# Altium project edirnekapi.PrjPcb (part 1 of 2)
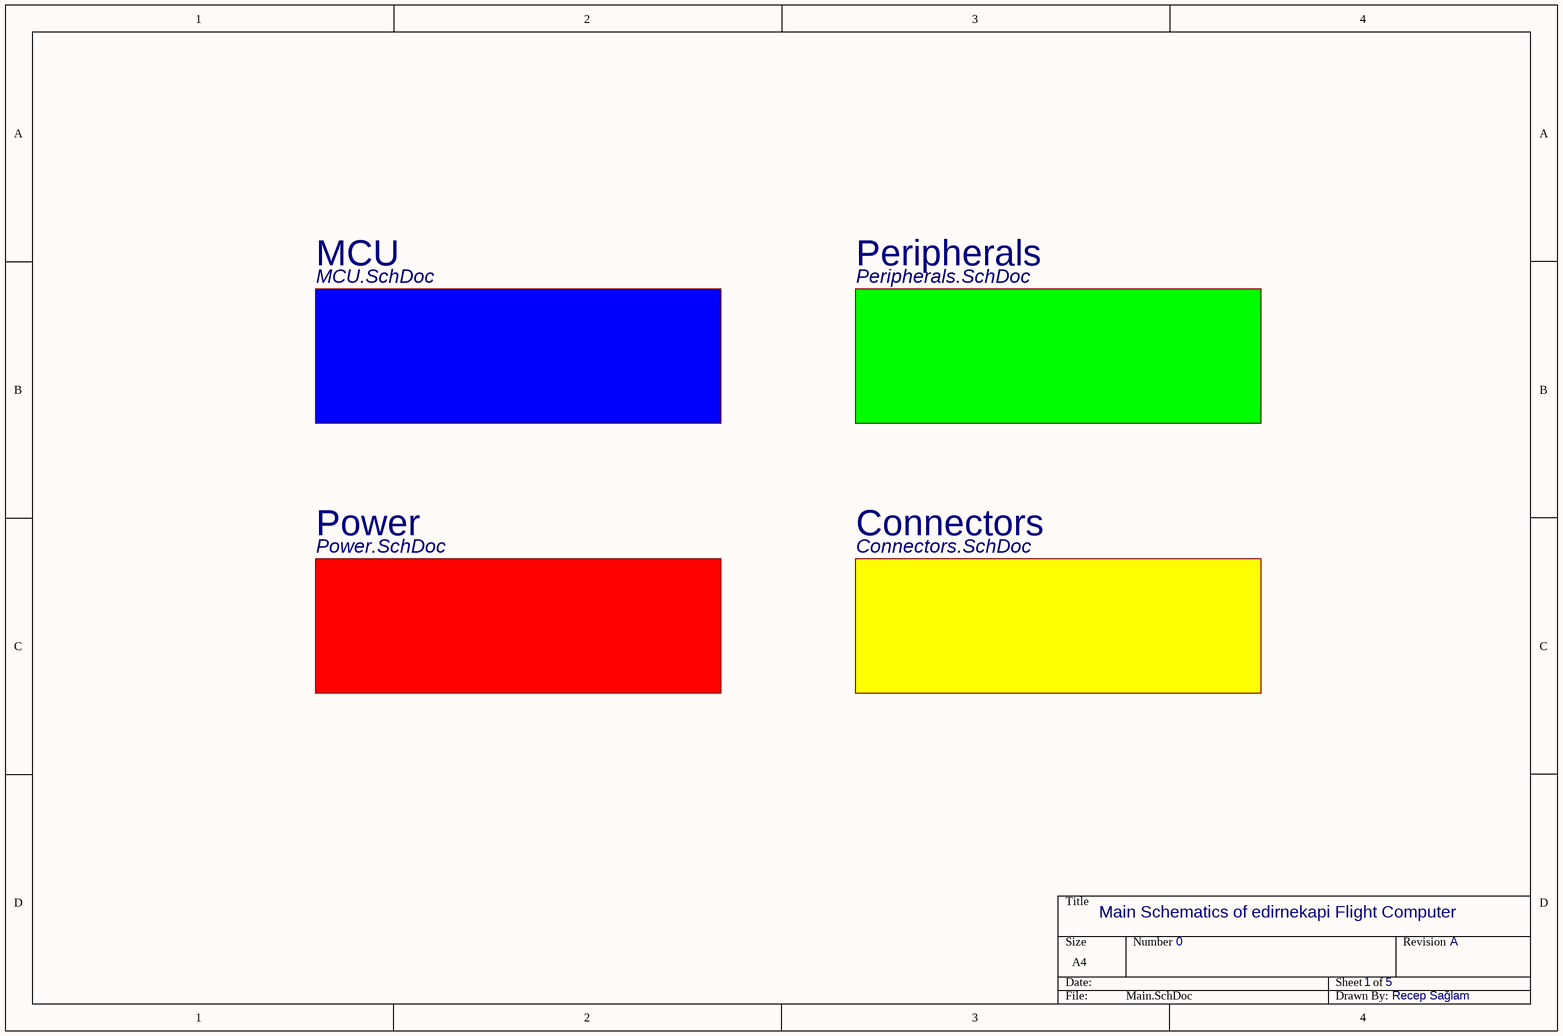
[diagram p0: Main.SchDoc]
5 sheets, 104 parts. Net scope: flat (ports and power ports of the same name join across sheets).
Board file: X3.PcbDoc
Sheets:
  Main.SchDoc
    MCU = MCU.SchDoc
    Peripherals = Peripherals.SchDoc
    Power = Power.SchDoc
    Connectors = Connectors.SchDoc

## Sheet Main.SchDoc
size A4; SheetNumber: 1; SheetTotal: 5

### Sub-sheets
Connectors = Connectors.SchDoc: no entries
MCU = MCU.SchDoc: no entries
Peripherals = Peripherals.SchDoc: no entries
Power = Power.SchDoc: no entries

### Notes on the sheet
- Main Schematics of edirnekapi Flight Computer
- 0
- 1
- 5
- A
- Recep Sağlam

## Sheet MCU.SchDoc
size Letter; SheetNumber: 2; SheetTotal: 5
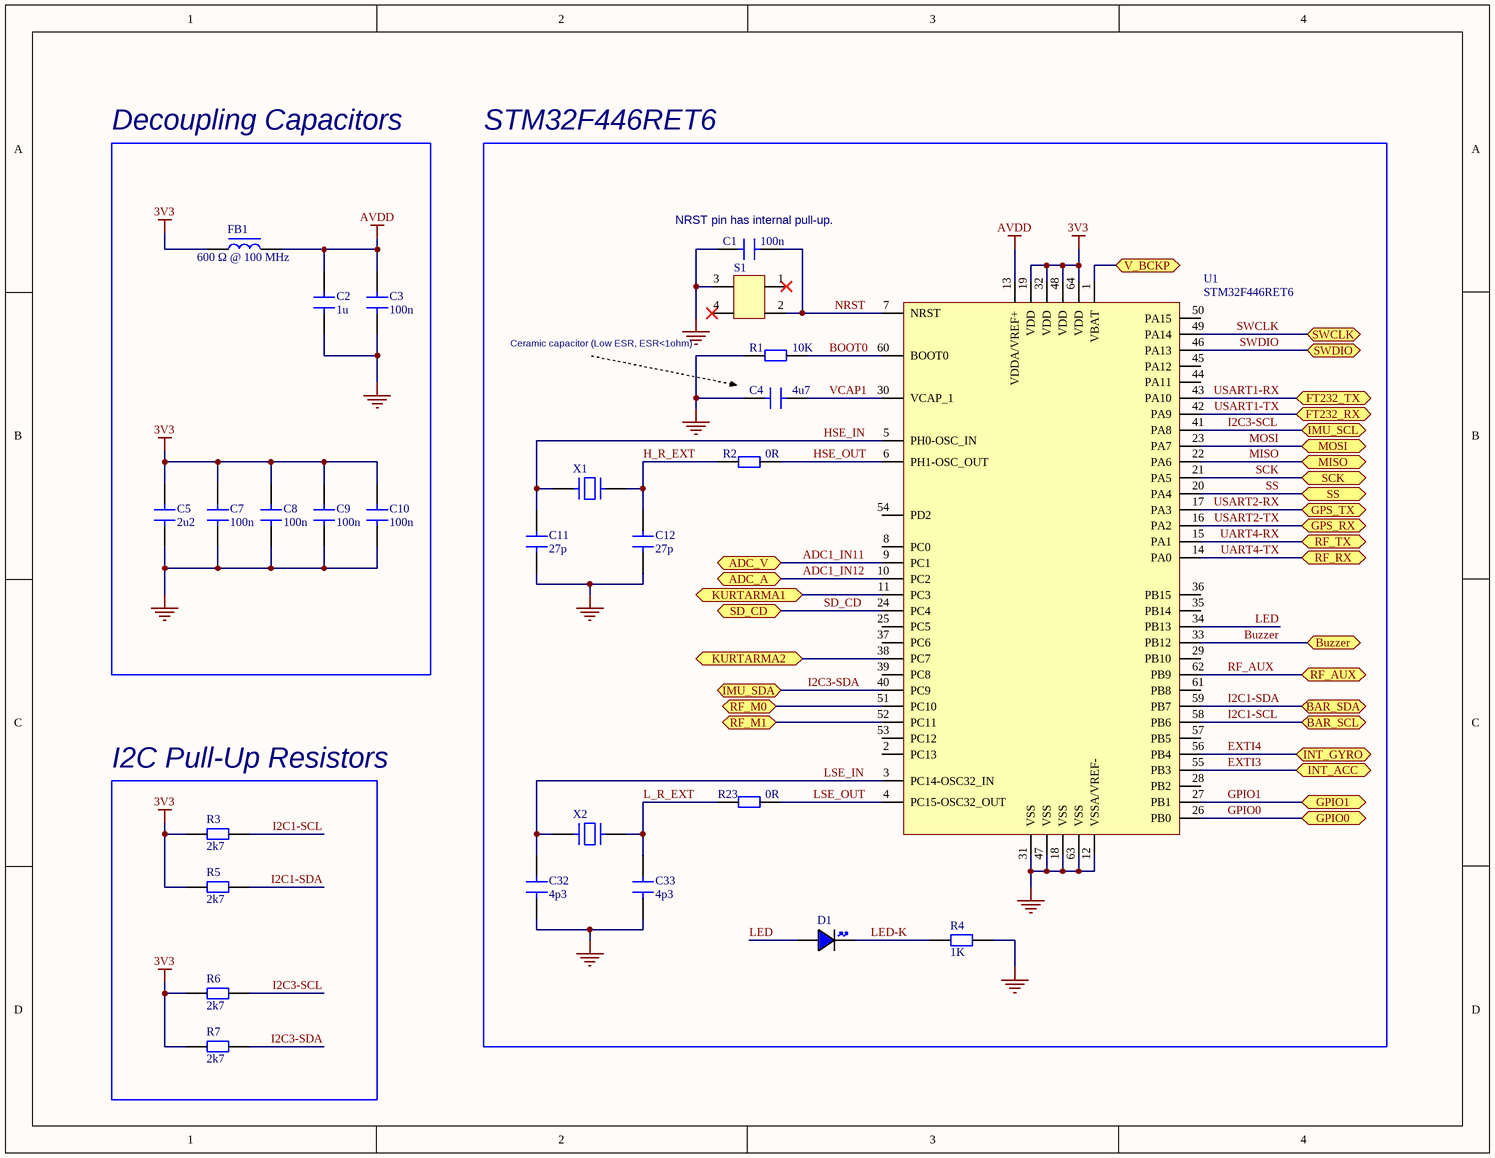
[diagram p1: MCU.SchDoc]

### Parts
C1  100n  [CAP 0603]
C2  1u  [CAP 0805]
C3  100n  [CAP 0603]
C4  4u7  [CAP 0805]
C5  2u2  [CAP 0805]
C7  100n  [CAP 0603]
C8  100n  [CAP 0603]
C9  100n  [CAP 0603]
C10  100n  [CAP 0603]
C11  27p  [CAP 0603]
C12  27p  [CAP 0603]
C32  4p3  [CAP 0603]
C33  4p3  [CAP 0603]
D1  LED 0805 BLUE  [LED 0805 BLUE]  (value not drawn)
FB1  600 Ω @ 100 MHz  [FB 0805]
R1  10K  [RES 0603]
R2  0R  [RES 0603]
R3  2k7  [RES 0603]
R4  1K  [RES 0603]
R5  2k7  [RES 0603]
R6  2k7  [RES 0603]
R7  2k7  [RES 0603]
R23  0R  [RES 0603]
S1  FSM4JSMATR  [FSM4JSMATR]  (value not drawn)
U1  STM32F446RET6  [STM32F446RET6]
X1  ABM3-8.000MHZ-D2Y-T  [ABM3-8.000MHZ-D2Y-T]  (value not drawn)
X2  ABS25-32.768KHZ-6-T  [ABS25-32.768KHZ-6-T]  (value not drawn)

### Blocks framed on the sheet
Decoupling Capacitors: C2 C3 C5 C7-C10 FB1
STM32F446RET6: C1 C4 C11 C12 C32 C33 D1 R1 R2 R4 R23 S1 U1 X1 X2
I2C Pull-Up Resistors: R3 R5-R7

### Ports
ADC_A (bidir, see Power[2D]), ADC_V (bidir, see Power[1C]), BAR_SCL (bidir, see Connectors[3C], Peripherals[3A]), BAR_SDA (bidir, see Connectors[3C], Peripherals[3A]), Buzzer (bidir, see Peripherals[6C]), FT232_RX (bidir, see Connectors[2A]), FT232_TX (bidir, see Connectors[2A]), GPIO0 (bidir, see Connectors[4A]), GPIO1 (bidir, see Connectors[4B]), GPS_RX (bidir, see Peripherals[5C]), GPS_TX (bidir, see Peripherals[5C]), IMU_SCL (bidir, see Connectors[4C], Peripherals[5A]), IMU_SDA (bidir, see Connectors[4C], Peripherals[5A]), INT_ACC (bidir, see Peripherals[6A]), INT_GYRO (bidir, see Peripherals[6A]), KURTARMA1 (bidir, see Peripherals[3D]), KURTARMA2 (bidir, see Peripherals[5D]), MISO (bidir, see Connectors[3A]), MOSI (bidir, see Connectors[3A]), RF_AUX (bidir, see Peripherals[2B], Peripherals[3C]), RF_M0 (bidir, see Peripherals[2C], Peripherals[3B]), RF_M1 (bidir, see Peripherals[2C], Peripherals[3B]), RF_RX (bidir, see Peripherals[2B], Peripherals[3B]), RF_TX (bidir, see Peripherals[2B], Peripherals[3B]), SCK (bidir, see Connectors[3A]), SD_CD (bidir, see Connectors[3B]), SS (bidir, see Connectors[3B]), SWCLK (bidir, see Connectors[2C]), SWDIO (bidir, see Connectors[2D]), V_BCKP (bidir, see Peripherals[5B], Power[3C])

### Nets
3V3: C5.2 C7.2 C8.2 C9.2 C10.2 FB1.1 R3.2 R5.2 R6.2 R7.2 U1.19(VDD) U1.32(VDD) U1.48(VDD) U1.64(VDD)
AVDD: C2.2 C3.2 FB1.2 U1.13(VDDA/VREF+)
GND: C1.1 C2.1 C3.1 C4.1 C5.1 C7.1 C8.1 C9.1 C10.1 C11.1 C12.1 C32.1 C33.1 R1.1 R4.2 S1.3 U1.12(VSSA/VREF-) U1.18(VSS) U1.31(VSS) U1.47(VSS) U1.63(VSS)
ADC1_IN11: U1.9(PC1) ; port ADC_V
ADC1_IN12: U1.10(PC2) ; port ADC_A
BOOT0: R1.2 U1.60(BOOT0)
Buzzer: U1.33(PB12) ; port Buzzer
EXTI3: U1.55(PB3) ; port INT_ACC
EXTI4: U1.56(PB4) ; port INT_GYRO
GPIO0: U1.26(PB0) ; port GPIO0
GPIO1: U1.27(PB1) ; port GPIO1
H_R_EXT: C12.2 R2.1 X1.2
HSE_IN: C11.2 U1.5(PH0-OSC_IN) X1.1
HSE_OUT: R2.2 U1.6(PH1-OSC_OUT)
I2C1-SCL: R3.1 U1.58(PB6) ; port BAR_SCL
I2C1-SDA: R5.1 U1.59(PB7) ; port BAR_SDA
I2C3-SCL: R6.1 U1.41(PA8) ; port IMU_SCL
I2C3-SDA: R7.1 U1.40(PC9) ; port IMU_SDA
L_R_EXT: C33.2 R23.1 X2.4
LED: D1.A U1.34(PB13)
LED-K: D1.K R4.1
LSE_IN: C32.2 U1.3(PC14-OSC32_IN) X2.1
LSE_OUT: R23.2 U1.4(PC15-OSC32_OUT)
MISO: U1.22(PA6) ; port MISO
MOSI: U1.23(PA7) ; port MOSI
NRST: C1.2 S1.2 U1.7(NRST)
RF_AUX: U1.62(PB9) ; port RF_AUX
SCK: U1.21(PA5) ; port SCK
SD_CD: U1.24(PC4) ; port SD_CD
SS: U1.20(PA4) ; port SS
SWCLK: U1.49(PA14) ; port SWCLK
SWDIO: U1.46(PA13) ; port SWDIO
UART4-RX: U1.15(PA1) ; port RF_TX
UART4-TX: U1.14(PA0) ; port RF_RX
USART1-RX: U1.43(PA10) ; port FT232_TX
USART1-TX: U1.42(PA9) ; port FT232_RX
USART2-RX: U1.17(PA3) ; port GPS_TX
USART2-TX: U1.16(PA2) ; port GPS_RX
VCAP1: C4.2 U1.30(VCAP_1)
NetC34_2: U1.1(VBAT) ; port V_BCKP
NetJ16_1: U1.51(PC10) ; port RF_M0
NetJ16_2: U1.52(PC11) ; port RF_M1
NetR18_1: U1.11(PC3) ; port KURTARMA1
NetR19_1: U1.38(PC7) ; port KURTARMA2

Not connected (* = marked no-connect by the designer): S1 1* 4*; U1 2(PC13) 8(PC0) 25(PC5) 28(PB2) 29(PB10) 35(PB14) 36(PB15) 37(PC6) 39(PC8) 44(PA11) 45(PA12) 50(PA15) 53(PC12) 54(PD2) 57(PB5) 61(PB8)

### Notes on the sheet
- (near C1) NRST pin has internal pull-up.
- Ceramic capacitor (Low ESR, ESR<1ohm)

### Library data of the parts
C1 C3 C7-C12 C32 C33 = CAP 0603 50V: Capacitor SMD 0603 50V
C2 = CAP 0805 50V: Capacitor SMD 0805 50V
C4 C5 = CAP 0805 25V: Capacitor SMD 0805 25V
D1 = LED 0805 BLUE: LED 0805 BLUE SMD
FB1 = FB 0805: Ferrite Bead SMD 0805
R1-R7 R23 = RES 0603: Resistor SMD 0603
S1 = FSM4JSMATR: Switch Tactile OFF (ON) SPST Round Button Gull Wing 0.05A 24VDC 1.57N SMD T/R; Manufacturer: TE Connectivity Alcoswitch; Supplier 1: Digi-Key; Manufacturer Part Number: FSM4JSMATR; RoHS: Yes; Category: Pushbutton Switches; Stock 1: 84996; Pricing 1: 1=0,36, 10=0,351, 25=0,33, 100=0,2866, 250=0,26, 500=0,24188 (USD); ComponentLink1URL: https://datasheet.ciiva.com/16320/eng-cs-1308111-1-switches-core-program-catalog-0308-16320065.pdf?src-supplier=Future+Electronics; ComponentLink1Description: https://datasheet.ciiva.com/16320/eng-cs-1308111-1-switches-core-program-catalog-0308-16320065.pdf?src-supplier=Future+Electronics; ComponentLink2URL: https://datasheet.ciiva.com/1530/1683375-1530944.pdf?src-supplier=Element14; ComponentLink2Description: https://datasheet.ciiva.com/1530/1683375-1530944.pdf?src-supplier=Element14; ComponentLink3URL: https://datasheet.ciiva.com/23765/1486934-23765878.pdf?src-supplier=Newark; ComponentLink3Description: https://datasheet.ciiva.com/23765/1486934-23765878.pdf?src-supplier=Newark; ComponentLink4URL: https://datasheet.ciiva.com/7638/921681-7638037.pdf?src-supplier=Element14; ComponentLink4Description: https://datasheet.ciiva.com/7638/921681-7638037.pdf?src-supplier=Element14
U1 = STM32F446RET6: ARM® Cortex®-M4 STM32 F4 Microcontroller IC 32-Bit 180MHz 512KB (512K x 8) FLASH 64-LQFP (10x10); Manufacturer: STMicroelectronics; Supplier 1: Mouser; Manufacturer Part Number: STM32F446RET6; RoHS: Yes; Category: Microcontrollers; Stock 1: 2954; Pricing 1: 1=12,45, 10=11,25, 50=10,54, 100=9,5, 1000=6,72, 10000=6,72 (USD); ComponentLink1URL: http://www.mouser.com/ds/2/389/stm32f446mc-956216.pdf?src-supplier=Mouser; ComponentLink1Description: http://www.mouser.com/ds/2/389/stm32f446mc-956216.pdf?src-supplier=Mouser; ComponentLink2URL: http://www.farnell.com/datasheets/2309063.pdf?src-supplier=Farnell; ComponentLink2Description: http://www.farnell.com/datasheets/2309063.pdf?src-supplier=Farnell; ComponentLink3URL: https://datasheet.octopart.com/STM32F446RET6-STMicroelectronics-datasheet-58295083.pdf?src-supplier=Future+Electronics; ComponentLink3Description: https://datasheet.octopart.com/STM32F446RET6-STMicroelectronics-datasheet-58295083.pdf?src-supplier=Future+Electronics; ComponentLink4URL: http://www.st.com/content/ccc/resource/technical/document/datasheet/65/cb/75/50/53/d6/48/24/DM00141306.pdf/files/DM00141306.pdf/jcr:content/translations/en.DM00141306.pdf?src-supplier=Digi-Key; ComponentLink4Description: http://www.st.com/content/ccc/resource/technical/document/datasheet/65/cb/75/50/53/d6/48/24/DM00141306.pdf/files/DM00141306.pdf/jcr:content/translations/en.DM00141306.pdf?src-supplier=Digi-Key; ComponentLink5URL: http://www.farnell.com/datasheets/2309063.pdf?src-supplier=Element14; ComponentLink5Description: http://www.farnell.com/datasheets/2309063.pdf?src-supplier=Element14; ComponentLink6URL: https://datasheet.octopart.com/STM32F446RET6-STMicroelectronics-datasheet-41797127.pdf?src-supplier=Element14; ComponentLink6Description: https://datasheet.octopart.com/STM32F446RET6-STMicroelectronics-datasheet-41797127.pdf?src-supplier=Element14; ComponentLink7URL: http://www.farnell.com/datasheets/2309063.pdf?src-supplier=Newark; ComponentLink7Description: http://www.farnell.com/datasheets/2309063.pdf?src-supplier=Newark; ComponentLink8URL: https://datasheet.octopart.com/STM32F446RET6-STMicroelectronics-datasheet-83961502.pdf?src-supplier=SHENGYU+ELECTRONICS; ComponentLink8Description: https://datasheet.octopart.com/STM32F446RET6-STMicroelectronics-datasheet-83961502.pdf?src-supplier=SHENGYU+ELECTRONICS
X1 = ABM3-8.000MHZ-D2Y-T: Crystal 8MHz ±20ppm (Tol) ±30ppm (Stability) 18pF FUND 140Ohm 2-Pin Mini-CSMD T/R; Manufacturer: Abracon; Supplier 1: Future Electronics; Manufacturer Part Number: ABM3-8.000MHZ-D2Y-T; RoHS: Yes; Category: Crystals; Stock 1: 237000; Pricing 1: 1000=0,325, 2000=0,275, 3000=0,315, 4000=0,27, 5000=0,31, 10000=0,305, 20000=0,295 (USD); Reach SVHC Compliant: 4187SVHC; ComponentLink1URL: https://datasheet.ciiva.com/862/abm3-862465.pdf?src-supplier=Digikey; ComponentLink1Description: https://datasheet.ciiva.com/862/abm3-862465.pdf?src-supplier=Digikey
X2 = ABS25-32.768KHZ-6-T: Crystal, Plastic Molded 32.768Khz, 6Pf, 20Ppm-40+85C, 8 X 3.8 X 2.5 Rohs Compliant: Yes; Manufacturer: Abracon; Supplier 1: Future Electronics; Manufacturer Part Number: ABS25-32.768KHZ-6-T; RoHS: Yes; Category: Crystals; Stock 1: 399000; Pricing 1: 3000=0,375, 6000=0,365, 9000=0,365, 12000=0,36, 15000=0,35 (USD); ComponentLink1URL: https://datasheet.ciiva.com/854/abs25-854528.pdf?src-supplier=Digi-Key; ComponentLink1Description: https://datasheet.ciiva.com/854/abs25-854528.pdf?src-supplier=Digi-Key; ComponentLink2URL: https://datasheet.ciiva.com/26909/getdatasheetpartid-722397-26909970.pdf?src-supplier=Verical; ComponentLink2Description: https://datasheet.ciiva.com/26909/getdatasheetpartid-722397-26909970.pdf?src-supplier=Verical; ComponentLink3URL: https://datasheet.ciiva.com/854/abs25-854527.pdf?src-supplier=Digi-Key; ComponentLink3Description: https://datasheet.ciiva.com/854/abs25-854527.pdf?src-supplier=Digi-Key; ComponentLink4URL: https://datasheet.ciiva.com/854/abs25-854529.pdf?src-supplier=Digi-Key; ComponentLink4Description: https://datasheet.ciiva.com/854/abs25-854529.pdf?src-supplier=Digi-Key; ComponentLink5URL: https://datasheet.ciiva.com/5788/abs25-5788102.pdf?src-supplier=Farnell; ComponentLink5Description: https://datasheet.ciiva.com/5788/abs25-5788102.pdf?src-supplier=Farnell; ComponentLink6URL: https://datasheet.ciiva.com/1357/1856019-1357324.pdf?src-supplier=Element14; ComponentLink6Description: https://datasheet.ciiva.com/1357/1856019-1357324.pdf?src-supplier=Element14; ComponentLink7URL: https://datasheet.ciiva.com/7998/1856019-7998662.pdf?src-supplier=Element14; ComponentLink7Description: https://datasheet.ciiva.com/7998/1856019-7998662.pdf?src-supplier=Element14

## Sheet Peripherals.SchDoc
size A3; SheetNumber: 3; SheetTotal: 5
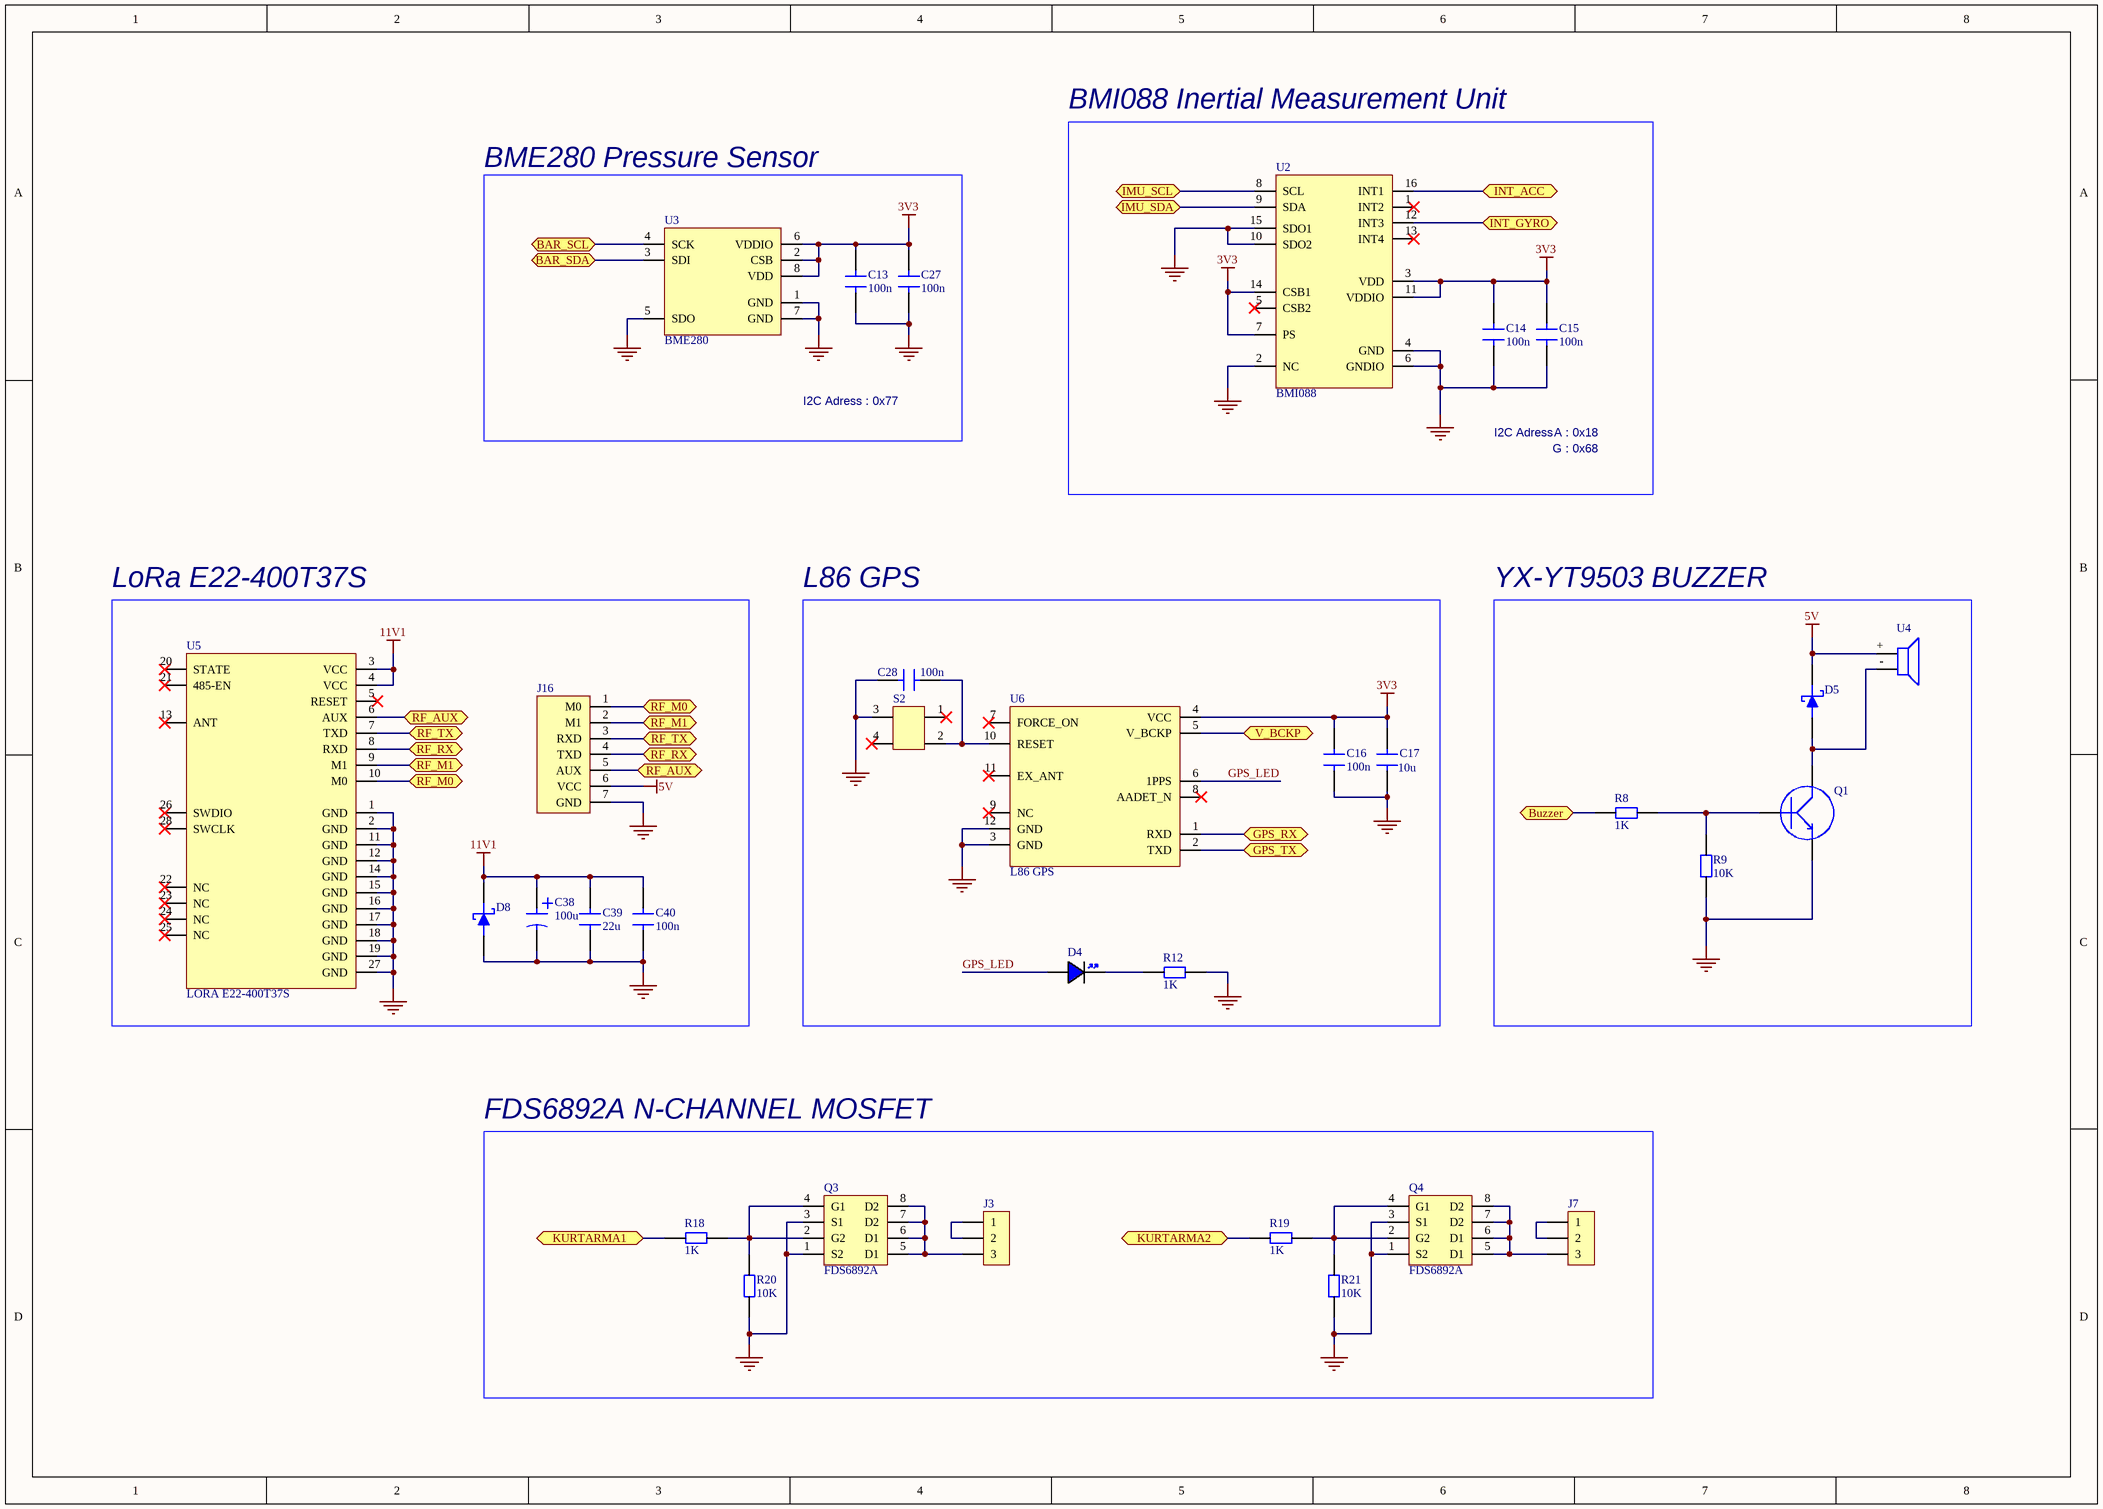
[diagram p2: Peripherals.SchDoc]

### Parts
C13  100n  [CAP 0603]
C14  100n  [CAP 0603]
C15  100n  [CAP 0603]
C16  100n  [CAP 0603]
C17  10u  [CAP 0805]
C27  100n  [CAP 0603]
C28  100n  [CAP 0603]
C38  100u  [865060653010]
C39  22u  [CAP 1210]
C40  100n  [CAP 0805]
D4  LED 0805 BLUE  [LED 0805 BLUE]  (value not drawn)
D5  TMBAT49FILM  [TMBAT49FILM]  (value not drawn)
D8  SMBJ14CA  [SMBJ12CA-13-F]  (value not drawn)
J3  JST B3B-XH-A  [JST_B3B-XH-A]  (value not drawn)
J7  JST B3B-XH-A  [JST_B3B-XH-A]  (value not drawn)
J16  LoRa E22-433T30D H  [LoRa E22-433T30D H]  (value not drawn)
Q1  BC817-25W,115  [BC817-25]  (value not drawn)
Q3  FDS6892A  [DMG4822SSD-13]
Q4  FDS6892A  [DMG4822SSD-13]
R8  1K  [RES 0603]
R9  10K  [RES 0603]
R12  1K  [RES 0603]
R18  1K  [RES 0805]
R19  1K  [RES 0805]
R20  10K  [RES 0805]
R21  10K  [RES 0805]
S2  FSM4JSMATR  [FSM4JSMATR]  (value not drawn)
U2  BMI088  [BMI088]
U3  BME280  [BME280]
U4  YX-YT9503  [YX-YT9503]  (value not drawn)
U5  LORA E22-400T37S  [LORA E22-400T37S]
U6  L86 GPS  [L86]

### Blocks framed on the sheet
BMI088 Inertial Measurement Unit: C14 C15 U2
BME280 Pressure Sensor: C13 C27 U3
LoRa E22-400T37S: C38-C40 D8 J16 U5
L86 GPS: C16 C17 C28 D4 R12 S2 U6
YX-YT9503 BUZZER: D5 Q1 R8 R9 U4
FDS6892A N-CHANNEL MOSFET: J3 J7 Q3 Q4 R18-R21

### Ports
BAR_SCL (bidir, see Connectors[3C], MCU[4C]), BAR_SDA (bidir, see Connectors[3C], MCU[4C]), Buzzer (bidir, see MCU[4C]), GPS_RX (bidir, see MCU[4B]), GPS_TX (bidir, see MCU[4B]), IMU_SCL (bidir, see Connectors[4C], MCU[4B]), IMU_SDA (bidir, see Connectors[4C], MCU[2C]), INT_ACC (bidir, see MCU[4C]), INT_GYRO (bidir, see MCU[4C]), KURTARMA1 (bidir, see MCU[2C]), KURTARMA2 (bidir, see MCU[2C]), RF_AUX (bidir, see MCU[4C], Peripherals[2B]), RF_AUX (bidir, see MCU[4C], Peripherals[3C]), RF_M0 (bidir, see MCU[2C], Peripherals[2C]), RF_M0 (bidir, see MCU[2C], Peripherals[3B]), RF_M1 (bidir, see MCU[2C], Peripherals[2C]), RF_M1 (bidir, see MCU[2C], Peripherals[3B]), RF_RX (bidir, see MCU[4B], Peripherals[2B]), RF_RX (bidir, see MCU[4B], Peripherals[3B]), RF_TX (bidir, see MCU[4B], Peripherals[2B]), RF_TX (bidir, see MCU[4B], Peripherals[3B]), V_BCKP (bidir, see MCU[3A], Power[3C])

### Nets
3V3: C13.2 C14.2 C15.2 C16.2 C17.2 C27.2 U2.3(VDD) U2.7(PS) U2.11(VDDIO) U2.14(CSB1) U3.2(CSB) U3.6(VDDIO) U3.8(VDD) U6.4(VCC)
5V: D5.1 J16.6(VCC) U4.+
11V1: C38.1(P) C39.2 C40.2 D8.2 U5.3(VCC) U5.4(VCC)
GND: C13.1 C14.1 C15.1 C16.1 C17.1 C27.1 C28.1 C38.2(N) C39.1 C40.1 D8.1 J16.7(GND) Q1.2(E) Q3.1(S2) Q3.3(S1) Q4.1(S2) Q4.3(S1) R9.1 R12.2 R20.1 R21.1 S2.3 U2.2(NC) U2.4(GND) U2.6(GNDIO) U2.10(SDO2) U2.15(SDO1) U3.1(GND) U3.5(SDO) U3.7(GND) U5.1(GND) U5.2(GND) U5.11(GND) U5.12(GND) U5.14(GND) U5.15(GND) U5.16(GND) U5.17(GND) U5.18(GND) U5.19(GND) U5.27(GND) U6.3(GND) U6.12(GND)
Buzzer: R8.1 ; port Buzzer
EXTI3: U2.16(INT1) ; port INT_ACC
EXTI4: U2.12(INT3) ; port INT_GYRO
GPS_LED: D4.A U6.6(1PPS)
I2C1-SCL: U3.4(SCK) ; port BAR_SCL
I2C1-SDA: U3.3(SDI) ; port BAR_SDA
I2C3-SCL: U2.8(SCL) ; port IMU_SCL
I2C3-SDA: U2.9(SDA) ; port IMU_SDA
RF_AUX: J16.5(AUX) U5.6(AUX) ; port RF_AUX
UART4-RX: J16.3(RXD) U5.7(TXD) ; port RF_TX
UART4-TX: J16.4(TXD) U5.8(RXD) ; port RF_RX
USART2-RX: U6.2(TXD) ; port GPS_TX
USART2-TX: U6.1(RXD) ; port GPS_RX
NetC28_2: C28.2 S2.2 U6.10(RESET)
NetC34_2: U6.5(V_BCKP) ; port V_BCKP
NetD4_K: D4.K R12.1
NetD5_2: D5.2 Q1.3(C) U4.-
NetJ3_1: J3.1 J3.2
NetJ3_3: J3.3 Q3.5(D1) Q3.6(D1) Q3.7(D2) Q3.8(D2)
NetJ7_1: J7.1 J7.2
NetJ7_3: J7.3 Q4.5(D1) Q4.6(D1) Q4.7(D2) Q4.8(D2)
NetJ16_1: J16.1(M0) U5.10(M0) ; port RF_M0
NetJ16_2: J16.2(M1) U5.9(M1) ; port RF_M1
NetQ1_1: Q1.1(B) R8.2 R9.2
NetQ3_2: Q3.2(G2) Q3.4(G1) R18.2 R20.2
NetQ4_2: Q4.2(G2) Q4.4(G1) R19.2 R21.2
NetR18_1: R18.1 ; port KURTARMA1
NetR19_1: R19.1 ; port KURTARMA2

Not connected (* = marked no-connect by the designer): S2 1* 4*; U2 1(INT2)* 5(CSB2)* 13(INT4)*; U5 5(RESET)* 13(ANT)* 20(STATE)* 21(485-EN)* 22(NC)* 23(NC)* 24(NC)* 25(NC)* 26(SWDIO)* 28(SWCLK)*; U6 7(FORCE_ON)* 8(AADET_N)* 9(NC)* 11(EX_ANT)*

### Notes on the sheet
- I2C Adress : 0x77
- I2C Adress
- G : 0x68
- A : 0x18

### Library data of the parts
C13-C16 C27 C28 = CAP 0603 50V: Capacitor SMD 0603 50V
C17 = CAP 0805 25V: Capacitor SMD 0805 25V
C38 = 865060653010: Aluminum Electrolytic Capacitor, Polarized, Aluminum (wet), 50V, 20% +Tol, 20% -Tol, 100uF, Surface Mount, 3333; Manufacturer: Wurth Electronics; Supplier 1: Farnell; Manufacturer Part Number: 865060653010; RoHS: Yes; Category: Aluminum Electrolytic Capacitors; Stock 1: 176; Pricing 1: 1=0,825, 10=0,63, 50=0,551, 100=0,481, 200=0,427, 500=0,355, 2500=0,348, 5000=0,341 (EUR); ComponentLink1URL: http://www.farnell.com/datasheets/1880078.pdf?src-supplier=Farnell; ComponentLink1Description: http://www.farnell.com/datasheets/1880078.pdf?src-supplier=Farnell; ComponentLink2URL: http://www.farnell.com/datasheets/1880078.pdf?src-supplier=Newark; ComponentLink2Description: http://www.farnell.com/datasheets/1880078.pdf?src-supplier=Newark; ComponentLink3URL: http://www.farnell.com/datasheets/1880078.pdf?src-supplier=Element14; ComponentLink3Description: http://www.farnell.com/datasheets/1880078.pdf?src-supplier=Element14; ComponentLink4URL: https://katalog.we-online.de/pbs/datasheet/865060653010.pdf?src-supplier=Digikey; ComponentLink4Description: https://katalog.we-online.de/pbs/datasheet/865060653010.pdf?src-supplier=Digikey
C39 = CAP 1210 25V: Capacitor SMD 1210 25V
C40 = CAP 0805 50V: Capacitor SMD 0805 50V
D4 = LED 0805 BLUE: LED 0805 GREEN SMD
D5 = TMBAT49FILM: Rectifier Diode Small Signal Schottky Si 80V 0.5A 2-Pin MELF T/R; Manufacturer: STMicroelectronics; Supplier 1: Mouser; Manufacturer Part Number: TMBAT49FILM; RoHS: Yes; Category: Rectifier Diodes; Stock 1: 11456; Pricing 1: 1=0,55, 10=0,468, 50=0,468, 100=0,326, 1000=0,228, 10000=0,159 (USD); ComponentLink1URL: https://datasheet.ciiva.com/4715/cd00000809-92451-4715102.pdf?src-supplier=Mouser; ComponentLink1Description: https://datasheet.ciiva.com/4715/cd00000809-92451-4715102.pdf?src-supplier=Mouser; ComponentLink2URL: https://datasheet.ciiva.com/16988/0900766b80db299a-16988744.pdf?src-supplier=Allied+Electronics; ComponentLink2Description: https://datasheet.ciiva.com/16988/0900766b80db299a-16988744.pdf?src-supplier=Allied+Electronics; ComponentLink3URL: https://datasheet.ciiva.com/22697/1766334-22697011.pdf?src-supplier=Element14; ComponentLink3Description: https://datasheet.ciiva.com/22697/1766334-22697011.pdf?src-supplier=Element14; ComponentLink4URL: https://datasheet.ciiva.com/16501/cd00000809-16501349.pdf?src-supplier=Future+Electronics; ComponentLink4Description: https://datasheet.ciiva.com/16501/cd00000809-16501349.pdf?src-supplier=Future+Electronics; ComponentLink5URL: https://datasheet.ciiva.com/15144/getdatasheetpartid-39750-15144086.pdf?src-supplier=Verical; ComponentLink5Description: https://datasheet.ciiva.com/15144/getdatasheetpartid-39750-15144086.pdf?src-supplier=Verical; ComponentLink6URL: https://datasheet.ciiva.com/915/cd00000809-915819.pdf?src-supplier=Digikey; ComponentLink6Description: https://datasheet.ciiva.com/915/cd00000809-915819.pdf?src-supplier=Digikey; ComponentLink7URL: https://datasheet.ciiva.com/915/cd00000809-915820.pdf?src-supplier=Digikey; ComponentLink7Description: https://datasheet.ciiva.com/915/cd00000809-915820.pdf?src-supplier=Digikey; ComponentLink8URL: https://datasheet.ciiva.com/915/cd00000809-915821.pdf?src-supplier=Digikey; ComponentLink8Description: https://datasheet.ciiva.com/915/cd00000809-915821.pdf?src-supplier=Digikey; ComponentLink9URL: https://datasheet.ciiva.com/7622/1766334-7622348.pdf?src-supplier=Element14; ComponentLink9Description: https://datasheet.ciiva.com/7622/1766334-7622348.pdf?src-supplier=Element14; ComponentLink10URL: https://datasheet.ciiva.com/7964/cd00000809-7964118.pdf?src-supplier=Element14; ComponentLink10Description: https://datasheet.ciiva.com/7964/cd00000809-7964118.pdf?src-supplier=Element14
D8 = SMBJ14CA: TVS DIODE 14VWM 23.2VC DO214AA; Manufacturer: Littelfuse; Operating Supply Voltage: 14V; Max Surge Current: 25.9A; Number of Channels: 1; Polarity: Bidirectional; Breakdown Voltage: 15.6V; Clamping Voltage: 23.2V; Peak Pulse Power: 600W; Power Line Protection: No; Test Current: 1mA; Leakage Current: 1uA; Diode Type: ZENER; Max Breakdown Voltage: 17.2V; Supplier 1: Future Electronics; Manufacturer Part Number: SMBJ14CA; RoHS: Yes; Category: TVS Diodes; Stock 1: 1300; Pricing 1: 1=0,36, 15=0,29, 75=0,245, 300=0,205, 1500=0,163 (USD); Mount: Surface Mount; Case/Package: DO-214AA; Number of Pins: 2; Weight: 0.00328oz; Min Operating Temperature: -65°C; Max Operating Temperature: 150°C; Packaging: Tape and Reel; Package Quantity: 3000; Reverse Breakdown Voltage: 15.6V; Number of Bidirectional Channels: 1; Reverse Standoff Voltage: 14V; Min Breakdown Voltage: 15.6V; Number of Elements: 1; Peak Pulse Current: 25.9A; Voltage Rating (DC): 14V; Series: SMBJ; Direction: Bidirectional; Termination: SMD/SMT; Max Power Dissipation: 600W; Power Dissipation: 600W; Current: 1mA; Voltage: 14V; Clamping Voltage-Max: 23.2V; Length: 5.59mm; Width: 3.94mm; Height: 2.44mm; RoHS Compliant: Yes; Lead Free: Lead Free; Reach SVHC Compliant: No; ComponentLink1URL: https://datasheet.ciiva.com/331/littelfuse-tvs-diode-smbj-datasheet-pdf-331530.pdf?src-supplier=Digikey; ComponentLink1Description: https://datasheet.ciiva.com/331/littelfuse-tvs-diode-smbj-datasheet-pdf-331530.pdf?src-supplier=Digikey; ComponentLink2URL: https://datasheet.ciiva.com/331/littelfuse-tvs-diode-smbj-datasheet-pdf-331531.pdf?src-supplier=Digikey; ComponentLink2Description: https://datasheet.ciiva.com/331/littelfuse-tvs-diode-smbj-datasheet-pdf-331531.pdf?src-supplier=Digikey; ComponentLink3URL: https://datasheet.ciiva.com/331/littelfuse-tvs-diode-smbj-datasheet-pdf-331529.pdf?src-supplier=Digikey; ComponentLink3Description: https://datasheet.ciiva.com/331/littelfuse-tvs-diode-smbj-datasheet-pdf-331529.pdf?src-supplier=Digikey
J3 J7 = JST B3B-XH-A: Connector Header, XH Series, 3 Position, 2.50mm, Through Hole, Press-Fit, Solder, Natural; Manufacturer Part Number: B3B-XH-A(LF)(SN); Supplier 1: CoreStaff; Manufacturer: JST; RoHS: Yes; Category: Headers and Wire Housings; Stock 1: 2101; Pricing 1: 1=39,94, 10=25,1, 50=21,68, 100=18,25, 500=17,57, 1000=17,12, 2000=16,44, 4000=15,79 (JPY); ComponentLink1URL: https://datasheet.ciiva.com/26894/getdatasheetpartid-640434-26894454.pdf?src-supplier=Verical; ComponentLink1Description: https://datasheet.ciiva.com/26894/getdatasheetpartid-640434-26894454.pdf?src-supplier=Verical; ComponentLink2URL: https://datasheet.ciiva.com/26894/getdatasheetpartid-440399-26894778.pdf?src-supplier=Verical; ComponentLink2Description: https://datasheet.ciiva.com/26894/getdatasheetpartid-440399-26894778.pdf?src-supplier=Verical; ComponentLink3URL: https://datasheet.ciiva.com/11746/0900766b8082653f-11746520.pdf?src-supplier=Rs; ComponentLink3Description: https://datasheet.ciiva.com/11746/0900766b8082653f-11746520.pdf?src-supplier=Rs
J16 = LoRa E22-433T30D H: E220-400T30D LoRa Module Header
Q1 = BC817-25W,115: BC817 Series 45 V 500 mA NPN General Purpose Transistor - SOT-23; Manufacturer: Nexperia; Supplier 1: Future Electronics; Manufacturer Part Number: BC817-25W,115; RoHS: Yes; Category: BJTs; Stock 1: 99000; Pricing 1: 3000=0,0169, 12000=0,0162, 45000=0,0155, 90000=0,0152, 225000=0,0144 (USD); ComponentLink1URL: https://datasheet.octopart.com/BC817-25W%2C115-NXP-datasheet-29749.pdf?src-supplier=Future+Electronics; ComponentLink1Description: https://datasheet.octopart.com/BC817-25W%2C115-NXP-datasheet-29749.pdf?src-supplier=Future+Electronics; ComponentLink2URL: http://www.farnell.com/datasheets/699988.pdf?src-supplier=Newark; ComponentLink2Description: http://www.farnell.com/datasheets/699988.pdf?src-supplier=Newark; ComponentLink3URL: https://datasheet.octopart.com/BC817-25W%2C115-Nexperia-datasheet-155782301.pdf?src-supplier=TME; ComponentLink3Description: https://datasheet.octopart.com/BC817-25W%2C115-Nexperia-datasheet-155782301.pdf?src-supplier=TME; Supplier Part Number 1: 5067352
Q3 Q4 = FDS6892A: Dual N-Channel Logic Level PWM Optimized PowerTrench® MOSFET 20V, 7.5A, 18mΩ; Manufacturer: ON Semiconductor / Fairchild; Supplier 1: Arrow Electronics; Manufacturer Part Number: FDS6892A; RoHS: Yes; Category: MOSFETs; Stock 1: 45; Pricing 1: 1=0,4552, 539=0,4077 (USD); ComponentLink1URL: https://datasheet.ciiva.com/15137/getdatasheetpartid-60185-15137252.pdf?src-supplier=Verical; ComponentLink1Description: https://datasheet.ciiva.com/15137/getdatasheetpartid-60185-15137252.pdf?src-supplier=Verical; ComponentLink2URL: https://datasheet.ciiva.com/8114/fds6892a-8114609.pdf?src-supplier=Avnet; ComponentLink2Description: https://datasheet.ciiva.com/8114/fds6892a-8114609.pdf?src-supplier=Avnet; ComponentLink3URL: https://datasheet.ciiva.com/6076/89392-6076006.pdf?src-supplier=Farnell; ComponentLink3Description: https://datasheet.ciiva.com/6076/89392-6076006.pdf?src-supplier=Farnell; ComponentLink4URL: https://datasheet.ciiva.com/4442/fds6892a-108922-4442276.pdf?src-supplier=Mouser; ComponentLink4Description: https://datasheet.ciiva.com/4442/fds6892a-108922-4442276.pdf?src-supplier=Mouser; ComponentLink5URL: https://datasheet.ciiva.com/16777/fds6892a-16777782.pdf?src-supplier=Future+Electronics; ComponentLink5Description: https://datasheet.ciiva.com/16777/fds6892a-16777782.pdf?src-supplier=Future+Electronics; ComponentLink6URL: https://datasheet.ciiva.com/6386/fds6892a-6386538.pdf?src-supplier=Digikey; ComponentLink6Description: https://datasheet.ciiva.com/6386/fds6892a-6386538.pdf?src-supplier=Digikey
R8 R9 R12 = RES 0603: Resistor SMD 0603
R18-R21 = RES 0805: Resistor SMD 0805
S2 = FSM4JSMATR: as S1 on sheet MCU; Supplier 1: Digi-Key; Manufacturer Part Number: FSM4JSMATR; RoHS: Yes; Category: Pushbutton Switches; Stock 1: 84996; Pricing 1: 1=0,36, 10=0,351, 25=0,33, 100=0,2866, 250=0,26, 500=0,24188 (USD); ComponentLink1URL: https://datasheet.ciiva.com/16320/eng-cs-1308111-1-switches-core-program-catalog-0308-16320065.pdf?src-supplier=Future+Electronics; ComponentLink1Description: https://datasheet.ciiva.com/16320/eng-cs-1308111-1-switches-core-program-catalog-0308-16320065.pdf?src-supplier=Future+Electronics; ComponentLink2URL: https://datasheet.ciiva.com/1530/1683375-1530944.pdf?src-supplier=Element14; ComponentLink2Description: https://datasheet.ciiva.com/1530/1683375-1530944.pdf?src-supplier=Element14; ComponentLink3URL: https://datasheet.ciiva.com/23765/1486934-23765878.pdf?src-supplier=Newark; ComponentLink3Description: https://datasheet.ciiva.com/23765/1486934-23765878.pdf?src-supplier=Newark; ComponentLink4URL: https://datasheet.ciiva.com/7638/921681-7638037.pdf?src-supplier=Element14; ComponentLink4Description: https://datasheet.ciiva.com/7638/921681-7638037.pdf?src-supplier=Element14
U2 = BMI088: BMI088 Series 3.6 V 6 Axis Digital Output Accelerometer Motion Sensor - LGA-16; Manufacturer: Bosch Tools; Supplier 1: Arrow Electronics; Manufacturer Part Number: BMI088; RoHS: No; Category: Inertial Measurement Units (IMUs); Stock 1: 2228; Pricing 1: 1=3,4884, 10=3,3155, 25=3,2816, 50=3,2477, 100=3,2147, 500=3,1828 (USD); ComponentLink1URL: https://ae-bst.resource.bosch.com/media/_tech/media/product_flyer/Bosch_Sensortec_Product_flyer_BMI088.pdf?src-supplier=Digi-Key; ComponentLink1Description: https://ae-bst.resource.bosch.com/media/_tech/media/product_flyer/Bosch_Sensortec_Product_flyer_BMI088.pdf?src-supplier=Digi-Key; ComponentLink2URL: https://ae-bst.resource.bosch.com/media/_tech/media/application_notes/BST-MIS-HS001.pdf?src-supplier=Digi-Key; ComponentLink2Description: https://ae-bst.resource.bosch.com/media/_tech/media/application_notes/BST-MIS-HS001.pdf?src-supplier=Digi-Key
U3 = BME280: SENSOR PRESSURE HUMIDITY TEMP; Manufacturer: Bosch; Sensor Type: Temperature; Output Type: SPI,I2C; Accuracy: 3%; Response Time: 1s; Supplier 1: Future Electronics; Manufacturer Part Number: BME280; RoHS: No; Category: Temperature and Humidity Sensors; Stock 1: 5185; Pricing 1: 1=6,1, 20=5,53, 150=5,14, 1000=4,78, 5000=4,48 (USD); Mount: Surface Mount; Case/Package: LGA; Number of Pins: 8; Min Operating Temperature: -40°C; Max Operating Temperature: 85°C; Packaging: Cut Tape; Lead Free: Lead Free; ComponentLink1URL: https://ae-bst.resource.bosch.com/media/_tech/media/datasheets/BST-BME280-DS002.pdf?src-supplier=Digi-Key; ComponentLink1Description: https://ae-bst.resource.bosch.com/media/_tech/media/datasheets/BST-BME280-DS002.pdf?src-supplier=Digi-Key; ComponentLink2URL: https://ae-bst.resource.bosch.com/media/_tech/media/product_flyer/BME280_Productflyer_BST_20170109.pdf?src-supplier=Mouser; ComponentLink2Description: https://ae-bst.resource.bosch.com/media/_tech/media/product_flyer/BME280_Productflyer_BST_20170109.pdf?src-supplier=Mouser; ComponentLink3URL: https://ae-bst.resource.bosch.com/media/_tech/media/product_flyer/BME280_Productflyer_BST_20170109.pdf?src-supplier=Arrow+Electronics; ComponentLink3Description: https://ae-bst.resource.bosch.com/media/_tech/media/product_flyer/BME280_Productflyer_BST_20170109.pdf?src-supplier=Arrow+Electronics; ComponentLink4URL: https://ae-bst.resource.bosch.com/media/_tech/media/product_flyer/BME280_Productflyer_BST_20170109.pdf?src-supplier=NAC+Semi; ComponentLink4Description: https://ae-bst.resource.bosch.com/media/_tech/media/product_flyer/BME280_Productflyer_BST_20170109.pdf?src-supplier=NAC+Semi
U4 = YX-YT9503: BUZZER MAGNETIC WITH CIRCUIT 3V 2.7-KHZ THT
U5 = LORA E22-400T37S: E22-400T37S LoRa Module

## Sheet Power.SchDoc
size A4; SheetNumber: 4; SheetTotal: 5; SPICEModelCacheOQVMKSBN: <root> / <DocumentId>OQVMKSBN</DocumentId> / </root>
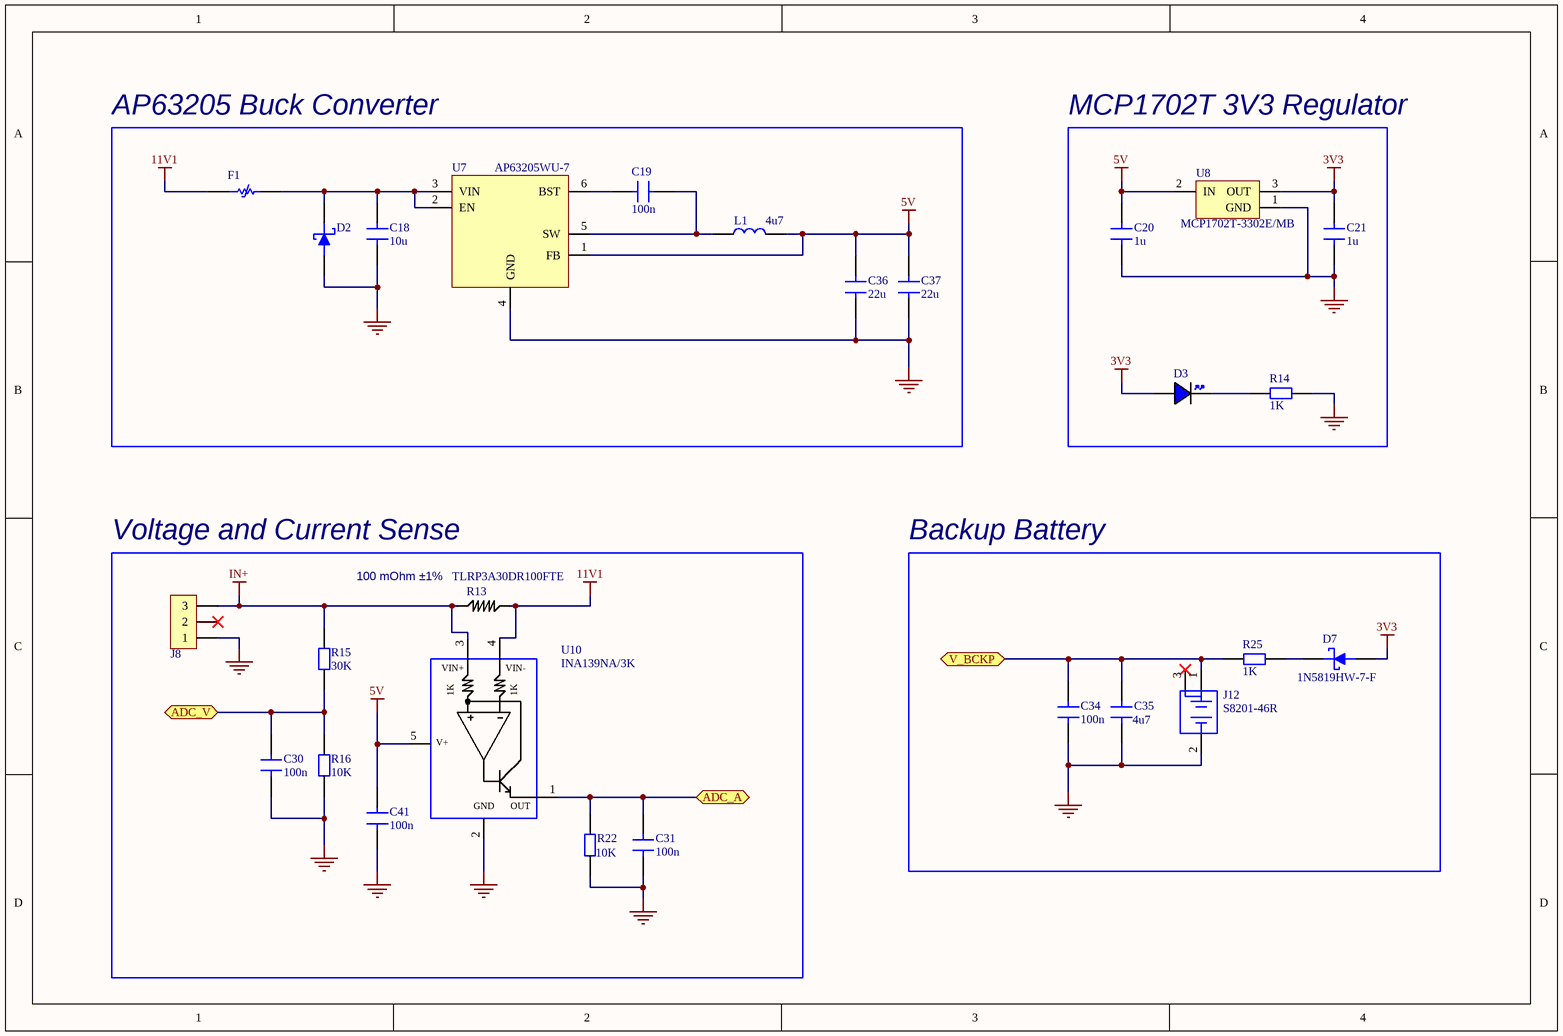
[diagram p3: Power.SchDoc]

### Parts
C18  10u  [CAP 1210]
C19  100n  [CAP 0805]
C20  1u  [CAP 0805]
C21  1u  [CAP 0805]
C30  100n  [CAP 0805]
C31  100n  [CAP 0805]
C34  100n  [CAP 0603]
C35  4u7  [CAP 0805]
C36  22u  [CAP 1210]
C37  22u  [CAP 1210]
C41  100n  [CAP 0805]
D2  SMBJ14CA  [SMBJ12CA-13-F]  (value not drawn)
D3  LED 0805 BLUE  [LED 0805 BLUE]  (value not drawn)
D7  1N5819HW-7-F  [1N5819HW-7-F]
F1  MF-MSMF075/24-2  [0ZCG0075FF2C]  (value not drawn)
J8  JST B3B-XH-A  [JST_B3B-XH-A]  (value not drawn)
J12  S8201-46R  [S8201-46R]
L1  4u7  [IHLP2020CZER4R7M11]
R13  TLRP3A30DR100FTE  [RES 2512]
R14  1K  [RES 0603]
R15  30K  [RES 0805]
R16  10K  [RES 0805]
R22  10K  [RES 0805]
R25  1K  [RES 0603]
U7  AP63205WU-7  [AP63205]
U8  MCP1702T-3302E/MB  [MCP1702T-3302E/MB]
U10  INA139NA/3K  [INA139NA]

### Blocks framed on the sheet
AP63205 Buck Converter: C18 C19 C36 C37 D2 F1 L1 U7
MCP1702T 3V3 Regulator: C20 C21 D3 R14 U8
Voltage and Current Sense: C30 C31 C41 J8 R13 R15 R16 R22 U10
Backup Battery: C34 C35 D7 J12 R25

### Ports
ADC_A (bidir, see MCU[2B]), ADC_V (bidir, see MCU[2B]), V_BCKP (bidir, see MCU[3A], Peripherals[5B])

### Nets
3V3: C21.2 D3.A D7.C U8.3(OUT)
5V: C20.2 C36.2 C37.2 C41.2 L1.2 U7.1(FB) U8.2(IN) U10.5(V+)
11V1: F1.1 R13.1 U10.4(VIN+)
GND: C18.1 C20.1 C21.1 C30.1 C31.1 C34.1 C35.1 C36.1 C37.1 C41.1 D2.1 J8.1 J12.2(-) R14.2 R16.1 R22.1 U7.4(GND) U8.1(GND) U10.2(GND)
IN+: J8.3 R13.2 R15.2 U10.3(VIN+)
ADC1_IN11: C30.2 R15.1 R16.2 ; port ADC_V
ADC1_IN12: C31.2 R22.2 U10.1(OUT) ; port ADC_A
NetC18_2: C18.2 D2.2 F1.2 U7.2(EN) U7.3(VIN)
NetC19_1: C19.1 L1.1 U7.5(SW)
NetC19_2: C19.2 U7.6(BST)
NetC34_2: C34.2 C35.2 J12.1(+) R25.1 ; port V_BCKP
NetD3_K: D3.K R14.1
NetD7_A: D7.A R25.2

Not connected (* = marked no-connect by the designer): J8 2*; J12 3(+)*

### Notes on the sheet
- (near R13) 100 mOhm ±1%
- (in symbol INA139NA/3K) VIN-; 1K

### Library data of the parts
C18 = CAP 1210 50V: Capacitor SMD 1210 50V
C19-C21 C30 C31 C41 = CAP 0805 50V: Capacitor SMD 0805 50V
C34 = CAP 0603 50V: Capacitor SMD 0603 50V
C35 = CAP 0805 25V: Capacitor SMD 0805 25V
C36 C37 = CAP 1210 25V: Capacitor SMD 1210 25V
D2 = SMBJ14CA: as D8 on sheet Peripherals; Supplier 1: Future Electronics; Manufacturer Part Number: SMBJ14CA; RoHS: Yes; Category: TVS Diodes; Stock 1: 1300; Pricing 1: 1=0,36, 15=0,29, 75=0,245, 300=0,205, 1500=0,163 (USD); Mount: Surface Mount; Case/Package: DO-214AA; Number of Pins: 2; Weight: 0.00328oz; Min Operating Temperature: -65°C; Max Operating Temperature: 150°C; Packaging: Tape and Reel; Package Quantity: 3000; Reverse Breakdown Voltage: 15.6V; Number of Bidirectional Channels: 1; Reverse Standoff Voltage: 14V; Min Breakdown Voltage: 15.6V; Number of Elements: 1; Peak Pulse Current: 25.9A; Voltage Rating (DC): 14V; Series: SMBJ; Direction: Bidirectional; Termination: SMD/SMT; Max Power Dissipation: 600W; Power Dissipation: 600W; Current: 1mA; Voltage: 14V; Clamping Voltage-Max: 23.2V; Length: 5.59mm; Width: 3.94mm; Height: 2.44mm; RoHS Compliant: Yes; Lead Free: Lead Free; Reach SVHC Compliant: No; ComponentLink1URL: https://datasheet.ciiva.com/331/littelfuse-tvs-diode-smbj-datasheet-pdf-331530.pdf?src-supplier=Digikey; ComponentLink1Description: https://datasheet.ciiva.com/331/littelfuse-tvs-diode-smbj-datasheet-pdf-331530.pdf?src-supplier=Digikey; ComponentLink2URL: https://datasheet.ciiva.com/331/littelfuse-tvs-diode-smbj-datasheet-pdf-331531.pdf?src-supplier=Digikey; ComponentLink2Description: https://datasheet.ciiva.com/331/littelfuse-tvs-diode-smbj-datasheet-pdf-331531.pdf?src-supplier=Digikey; ComponentLink3URL: https://datasheet.ciiva.com/331/littelfuse-tvs-diode-smbj-datasheet-pdf-331529.pdf?src-supplier=Digikey; ComponentLink3Description: https://datasheet.ciiva.com/331/littelfuse-tvs-diode-smbj-datasheet-pdf-331529.pdf?src-supplier=Digikey
D3 = LED 0805 BLUE: LED 0805 GREEN SMD
D7 = 1N5819HW-7-F: Rectifier Diode, Schottky, 1 Phase, 1 Element, 1A, 40V V(RRM), Silicon; Manufacturer: Diodes; Max Reverse Current: 50uA; Peak Non-Repetitive Surge Current: 25A; Forward Voltage: 450mV; Max Power Dissipation: 450mW; Polarity: Standard; Capacitance: 50pF; Supplier 1: Future Electronics; Manufacturer Part Number: 1N5819HW-7-F; RoHS: Yes; Category: Rectifier Diodes; Stock 1: 5079000; Pricing 1: 3000=0,0409, 9000=0,0394, 15000=0,0388, 60000=0,037, 90000=0,0358 (USD); Case/Package: SOD-123-2; Number of Pins: 2; Weight: 0.000353oz; Min Operating Temperature: -65°C; Max Operating Temperature: 125°C; Forward Current: 1A; Max Repetitive Reverse Voltage (Vrrm): 40V; Package Quantity: 3000; Packaging: Tape and Reel; Average Rectified Current: 1A; Max Forward Surge Current (Ifsm): 25A; Termination: SMD/SMT; Voltage Rating (DC): 40V; Current Rating: 1A; Output Current: 1A; Max Reverse Voltage (DC): 40V; Series: -; Reverse Voltage: 40V; Length: 2.85mm; Width: 1.7mm; Height: 1.25mm; Radiation Hardening: No; Reach SVHC Compliant: No; Lead Free: Lead Free; RoHS Compliant: Yes; ComponentLink1URL: https://datasheet.ciiva.com/27092/1538419-27092484.pdf?src-supplier=Jameco; ComponentLink1Description: https://datasheet.ciiva.com/27092/1538419-27092484.pdf?src-supplier=Jameco; ComponentLink2URL: https://datasheet.ciiva.com/16303/ds30217-16303296.pdf?src-supplier=Future+Electronics; ComponentLink2Description: https://datasheet.ciiva.com/16303/ds30217-16303296.pdf?src-supplier=Future+Electronics; ComponentLink3URL: https://datasheet.ciiva.com/1177/ds30217-1177089.pdf?src-supplier=Element14; ComponentLink3Description: https://datasheet.ciiva.com/1177/ds30217-1177089.pdf?src-supplier=Element14; ComponentLink4URL: https://datasheet.ciiva.com/8303/ds30217-8303132.pdf?src-supplier=Avnet; ComponentLink4Description: https://datasheet.ciiva.com/8303/ds30217-8303132.pdf?src-supplier=Avnet; ComponentLink5URL: https://datasheet.ciiva.com/912/ds30217-912802.pdf?src-supplier=Digikey; ComponentLink5Description: https://datasheet.ciiva.com/912/ds30217-912802.pdf?src-supplier=Digikey; ComponentLink6URL: https://datasheet.ciiva.com/912/ds30217-912803.pdf?src-supplier=Digikey; ComponentLink6Description: https://datasheet.ciiva.com/912/ds30217-912803.pdf?src-supplier=Digikey; ComponentLink7URL: https://datasheet.ciiva.com/912/ds30217-912801.pdf?src-supplier=Digikey; ComponentLink7Description: https://datasheet.ciiva.com/912/ds30217-912801.pdf?src-supplier=Digikey
F1 = MF-MSMF075/24-2: PTC Resettable Fuse 0.75A(hold) 1.5A(trip) 24V 40A 0.8W 0.2s 0.11Ohm SMD Solder Pad 1812 T/R Automotive; Manufacturer: Bourns; Supplier 1: Arrow Electronics; Manufacturer Part Number: MF-MSMF075/24-2; RoHS: Yes; Category: Fuses; Stock 1: 88000; Pricing 1: 4000=0,2686 (USD); Lead Free: 5697LeadFree; ComponentLink1URL: https://datasheet.ciiva.com/27091/1164226-27091560.pdf?src-supplier=Jameco; ComponentLink1Description: https://datasheet.ciiva.com/27091/1164226-27091560.pdf?src-supplier=Jameco; ComponentLink2URL: https://datasheet.ciiva.com/326/mfmsmf-326789.pdf?src-supplier=Digikey; ComponentLink2Description: https://datasheet.ciiva.com/326/mfmsmf-326789.pdf?src-supplier=Digikey; ComponentLink3URL: https://datasheet.ciiva.com/326/mfmsmf-326790.pdf?src-supplier=Digikey; ComponentLink3Description: https://datasheet.ciiva.com/326/mfmsmf-326790.pdf?src-supplier=Digikey; ComponentLink4URL: https://datasheet.ciiva.com/326/mfmsmf-326791.pdf?src-supplier=Digikey; ComponentLink4Description: https://datasheet.ciiva.com/326/mfmsmf-326791.pdf?src-supplier=Digikey; ComponentLink5URL: https://datasheet.ciiva.com/3019/mfmsmf-3019624.pdf?src-supplier=Avnet; ComponentLink5Description: https://datasheet.ciiva.com/3019/mfmsmf-3019624.pdf?src-supplier=Avnet; ComponentLink6URL: https://datasheet.ciiva.com/3019/mfmsmf-3019625.pdf?src-supplier=Avnet; ComponentLink6Description: https://datasheet.ciiva.com/3019/mfmsmf-3019625.pdf?src-supplier=Avnet; ComponentLink7URL: https://datasheet.ciiva.com/30254/575mfmsmf-30254266.pdf?src-supplier=Onlinecomponents.com; ComponentLink7Description: https://datasheet.ciiva.com/30254/575mfmsmf-30254266.pdf?src-supplier=Onlinecomponents.com; ComponentLink8URL: https://datasheet.ciiva.com/16205/mfmsmf-16205996.pdf?src-supplier=Onlinecomponents.com; ComponentLink8Description: https://datasheet.ciiva.com/16205/mfmsmf-16205996.pdf?src-supplier=Onlinecomponents.com; ComponentLink9URL: https://datasheet.ciiva.com/14539/70153434-14539177.pdf?src-supplier=Allied+Electronics; ComponentLink9Description: https://datasheet.ciiva.com/14539/70153434-14539177.pdf?src-supplier=Allied+Electronics; ComponentLink10URL: https://datasheet.ciiva.com/1228/1786007-1228156.pdf?src-supplier=Newark; ComponentLink10Description: https://datasheet.ciiva.com/1228/1786007-1228156.pdf?src-supplier=Newark; ComponentLink11URL: https://datasheet.ciiva.com/1274/1786007-1274502.pdf?src-supplier=Element14; ComponentLink11Description: https://datasheet.ciiva.com/1274/1786007-1274502.pdf?src-supplier=Element14; ComponentLink12URL: https://datasheet.ciiva.com/1274/1786007-1274503.pdf?src-supplier=Element14; ComponentLink12Description: https://datasheet.ciiva.com/1274/1786007-1274503.pdf?src-supplier=Element14
J8 = JST B3B-XH-A: as J3 on sheet Peripherals; Supplier 1: CoreStaff; Manufacturer: JST; RoHS: Yes; Category: Headers and Wire Housings; Stock 1: 2101; Pricing 1: 1=39,94, 10=25,1, 50=21,68, 100=18,25, 500=17,57, 1000=17,12, 2000=16,44, 4000=15,79 (JPY); ComponentLink1URL: https://datasheet.ciiva.com/26894/getdatasheetpartid-640434-26894454.pdf?src-supplier=Verical; ComponentLink1Description: https://datasheet.ciiva.com/26894/getdatasheetpartid-640434-26894454.pdf?src-supplier=Verical; ComponentLink2URL: https://datasheet.ciiva.com/26894/getdatasheetpartid-440399-26894778.pdf?src-supplier=Verical; ComponentLink2Description: https://datasheet.ciiva.com/26894/getdatasheetpartid-440399-26894778.pdf?src-supplier=Verical; ComponentLink3URL: https://datasheet.ciiva.com/11746/0900766b8082653f-11746520.pdf?src-supplier=Rs; ComponentLink3Description: https://datasheet.ciiva.com/11746/0900766b8082653f-11746520.pdf?src-supplier=Rs
J12 = S8201-46R: Battery Holder, Coin Cell, 1225, Smd Rohs Compliant: Yes |Harwin S8201-46R; Manufacturer: Harwin; Number of Contacts: 2NUMBER; Supplier 1: Farnell; Manufacturer Part Number: S8201-46R; RoHS: Yes; Category: Connectors; Stock 1: 4494; Pricing 1: 1=0,926, 25=0,765, 75=0,589, 200=0,555, 500=0,48 (EUR); Contact Material: 153,154ConductorMaterial; Height: 3.25mm; ComponentLink1URL: https://datasheet.ciiva.com/4/s8201r-4048.pdf?src-supplier=Digikey; ComponentLink1Description: https://datasheet.ciiva.com/4/s8201r-4048.pdf?src-supplier=Digikey; ComponentLink2URL: https://datasheet.ciiva.com/4642/c0430120-20coin20cell20battery20retainers-55143-4642583.pdf?src-supplier=Mouser; ComponentLink2Description: https://datasheet.ciiva.com/4642/c0430120-20coin20cell20battery20retainers-55143-4642583.pdf?src-supplier=Mouser; ComponentLink3URL: https://datasheet.ciiva.com/1391/1458706-1391064.pdf?src-supplier=Element14; ComponentLink3Description: https://datasheet.ciiva.com/1391/1458706-1391064.pdf?src-supplier=Element14; ComponentLink4URL: https://datasheet.ciiva.com/4/s8201r-4049.pdf?src-supplier=Digikey; ComponentLink4Description: https://datasheet.ciiva.com/4/s8201r-4049.pdf?src-supplier=Digikey
L1 = IHLP2020CZER4R7M11: Inductor Power Shielded Wirewound 4.7uH 20% 100KHz Powdered Iron 4.5A 60mOhm DCR 2020 T/R; Manufacturer: Vishay; Supplier 1: Mouser; Manufacturer Part Number: IHLP2020CZER4R7M11; RoHS: No; Category: Fixed Inductors; Stock 1: 10031; Pricing 1: 1=1,19, 10=1,02, 50=1,02, 100=0,828, 1000=0,828, 10000=0,473 (USD); ComponentLink1URL: https://datasheet.ciiva.com/14803/lp20cz11-14803040.pdf?src-supplier=Arrow+Electronics; ComponentLink1Description: https://datasheet.ciiva.com/14803/lp20cz11-14803040.pdf?src-supplier=Arrow+Electronics; ComponentLink2URL: https://datasheet.ciiva.com/11798/0900766b8102c930-11798346.pdf?src-supplier=Rs; ComponentLink2Description: https://datasheet.ciiva.com/11798/0900766b8102c930-11798346.pdf?src-supplier=Rs; ComponentLink3URL: https://datasheet.ciiva.com/22694/480942-22694470.pdf?src-supplier=Element14; ComponentLink3Description: https://datasheet.ciiva.com/22694/480942-22694470.pdf?src-supplier=Element14; ComponentLink4URL: https://datasheet.ciiva.com/8017/480942-8017228.pdf?src-supplier=Element14; ComponentLink4Description: https://datasheet.ciiva.com/8017/480942-8017228.pdf?src-supplier=Element14; ComponentLink5URL: https://datasheet.ciiva.com/8494/lp20cz11-8494950.pdf?src-supplier=Avnet; ComponentLink5Description: https://datasheet.ciiva.com/8494/lp20cz11-8494950.pdf?src-supplier=Avnet; ComponentLink6URL: https://datasheet.ciiva.com/17112/70205433-17112327.pdf?src-supplier=Allied+Electronics; ComponentLink6Description: https://datasheet.ciiva.com/17112/70205433-17112327.pdf?src-supplier=Allied+Electronics; ComponentLink7URL: https://datasheet.ciiva.com/6688/lp20cz11-6688326.pdf?src-supplier=Digikey; ComponentLink7Description: https://datasheet.ciiva.com/6688/lp20cz11-6688326.pdf?src-supplier=Digikey; ComponentLink8URL: https://datasheet.ciiva.com/6688/lp20cz11-6688327.pdf?src-supplier=Digikey; ComponentLink8Description: https://datasheet.ciiva.com/6688/lp20cz11-6688327.pdf?src-supplier=Digikey; ComponentLink9URL: https://datasheet.ciiva.com/6688/lp20cz11-6688329.pdf?src-supplier=Digikey; ComponentLink9Description: https://datasheet.ciiva.com/6688/lp20cz11-6688329.pdf?src-supplier=Digikey
R13 = TLRP3A30DR100FTE: Res, 0R1, 1%, 3W, Metal Strip, SMD Rohs Compliant: Yes; Manufacturer: TE Connectivity; Supplier 1: Farnell; Manufacturer Part Number: TLRP3A30DR100FTE; RoHS: No; Category: Chip SMD Resistors; Stock 1: 1580; Pricing 1: 10=0,393, 100=0,273, 500=0,221, 1000=0,179, 2000=0,177, 4000=0,166, 20000=0,163, 40000=0,159 (EUR)
R14 R25 = RES 0603: Resistor SMD 0603
R15 R16 R22 = RES 0805: Resistor SMD 0805
U7 = AP63205WU-7: AP63205 Series 32 V 2 A 1.1 MHz Synchronous Buck Converter -TSOT-26; Manufacturer: Diodes; Max Duty Cycle: 100%; Max Supply Voltage: 32V; Min Supply Voltage: 3.8V; Nominal Supply Current: 22uA; Number of Outputs: 1NUMBER; Output Current: 2A; Output Voltage: 5V; Switching Frequency: 1.1MHz; Supplier 1: Future Electronics; Manufacturer Part Number: AP63205WU-7; RoHS: Yes; Category: Voltage Regulators - Switching; Stock 1: 45000; Pricing 1: 3000=0,33, 6000=0,32 (USD); Min Operating Temperature: -40°C; Max Operating Temperature: 85°C; Height: 1mm; ComponentLink1URL: https://www.diodes.com/assets/Datasheets/AP63200-AP63201-AP63203-AP63205.pdf?src-supplier=Digikey; ComponentLink1Description: https://www.diodes.com/assets/Datasheets/AP63200-AP63201-AP63203-AP63205.pdf?src-supplier=Digikey
U8 = MCP1702T-3302E/MB: LDO Regulator Pos 3.3V 0.25A Automotive 4-Pin(3+Tab) SOT-89 T/R; Manufacturer: Microchip; Max Supply Voltage: 13.2V; Min Supply Voltage: 2.7V; Dropout Voltage: 525mV; Output Current: 250mA; Number of Outputs: 1; Input Bias Current: 2uA; Quiescent Current: 5uA; Polarity: Positive; Accuracy: 2%; Output Type: Fixed; Supplier 1: Arrow Electronics; Manufacturer Part Number: MCP1702T-3302E/MB; RoHS: Yes; Category: Voltage Regulators - Linear; Stock 1: 26000; Pricing 1: 1000=0,4964 (USD); Mount: Surface Mount; Case/Package: SOT-89; Number of Pins: 3; Min Operating Temperature: -40°C; Max Operating Temperature: 125°C; Max Input Voltage: 13.2V; Min Input Voltage: 2.7V; Max Output Current: 250mA; Output Voltage: 3.3V; Packaging: Tape and Reel; Package Quantity: 1000; Nominal Output Voltage: 3.3V; Number of Regulators: 1; Min Output Voltage: 3.3V; Max Output Voltage: 3.3V; Termination: SMD/SMT; Output Voltage Accuracy: 2%; Supply Current: 5uA; Length: 4.6mm; Width: 2.29mm; Height: 1.6mm; Reach SVHC Compliant: No; Lead Free: Lead Free; RoHS Compliant: Yes
U10 = INA139NA/3K: 2.7 to 36V, 440kHz Variable gain current sense amplifier 5-SOT-23 -40 to 125; Manufacturer: Texas Instruments; Supplier 1: Mouser; Manufacturer Part Number: INA139NA/3K; RoHS: Yes; Category: Amplifiers - Op Amps, Buffer, Instrumentation; Stock 1: 20541; Pricing 1: 1=1,5, 10=1,27, 50=1,27, 100=1,02, 1000=0,737, 10000=0,736 (USD); ComponentLink1URL: https://datasheet.ciiva.com/15128/getdatasheetpartid-248784-15128606.pdf?src-supplier=Verical; ComponentLink1Description: https://datasheet.ciiva.com/15128/getdatasheetpartid-248784-15128606.pdf?src-supplier=Verical; ComponentLink2URL: https://datasheet.ciiva.com/1939/ina139-1939992.pdf?src-supplier=Digikey; ComponentLink2Description: https://datasheet.ciiva.com/1939/ina139-1939992.pdf?src-supplier=Digikey; ComponentLink3URL: https://datasheet.ciiva.com/1939/ina139-1939993.pdf?src-supplier=Digikey; ComponentLink3Description: https://datasheet.ciiva.com/1939/ina139-1939993.pdf?src-supplier=Digikey; ComponentLink4URL: https://datasheet.ciiva.com/1939/ina139-1939994.pdf?src-supplier=Digikey; ComponentLink4Description: https://datasheet.ciiva.com/1939/ina139-1939994.pdf?src-supplier=Digikey; ComponentLink5URL: https://datasheet.ciiva.com/2976/ina169-2976115.pdf?src-supplier=Avnet; ComponentLink5Description: https://datasheet.ciiva.com/2976/ina169-2976115.pdf?src-supplier=Avnet